# EAGLE design kiibohd_at90usb_ext_i2c_l (EAGLE 7.4.0)
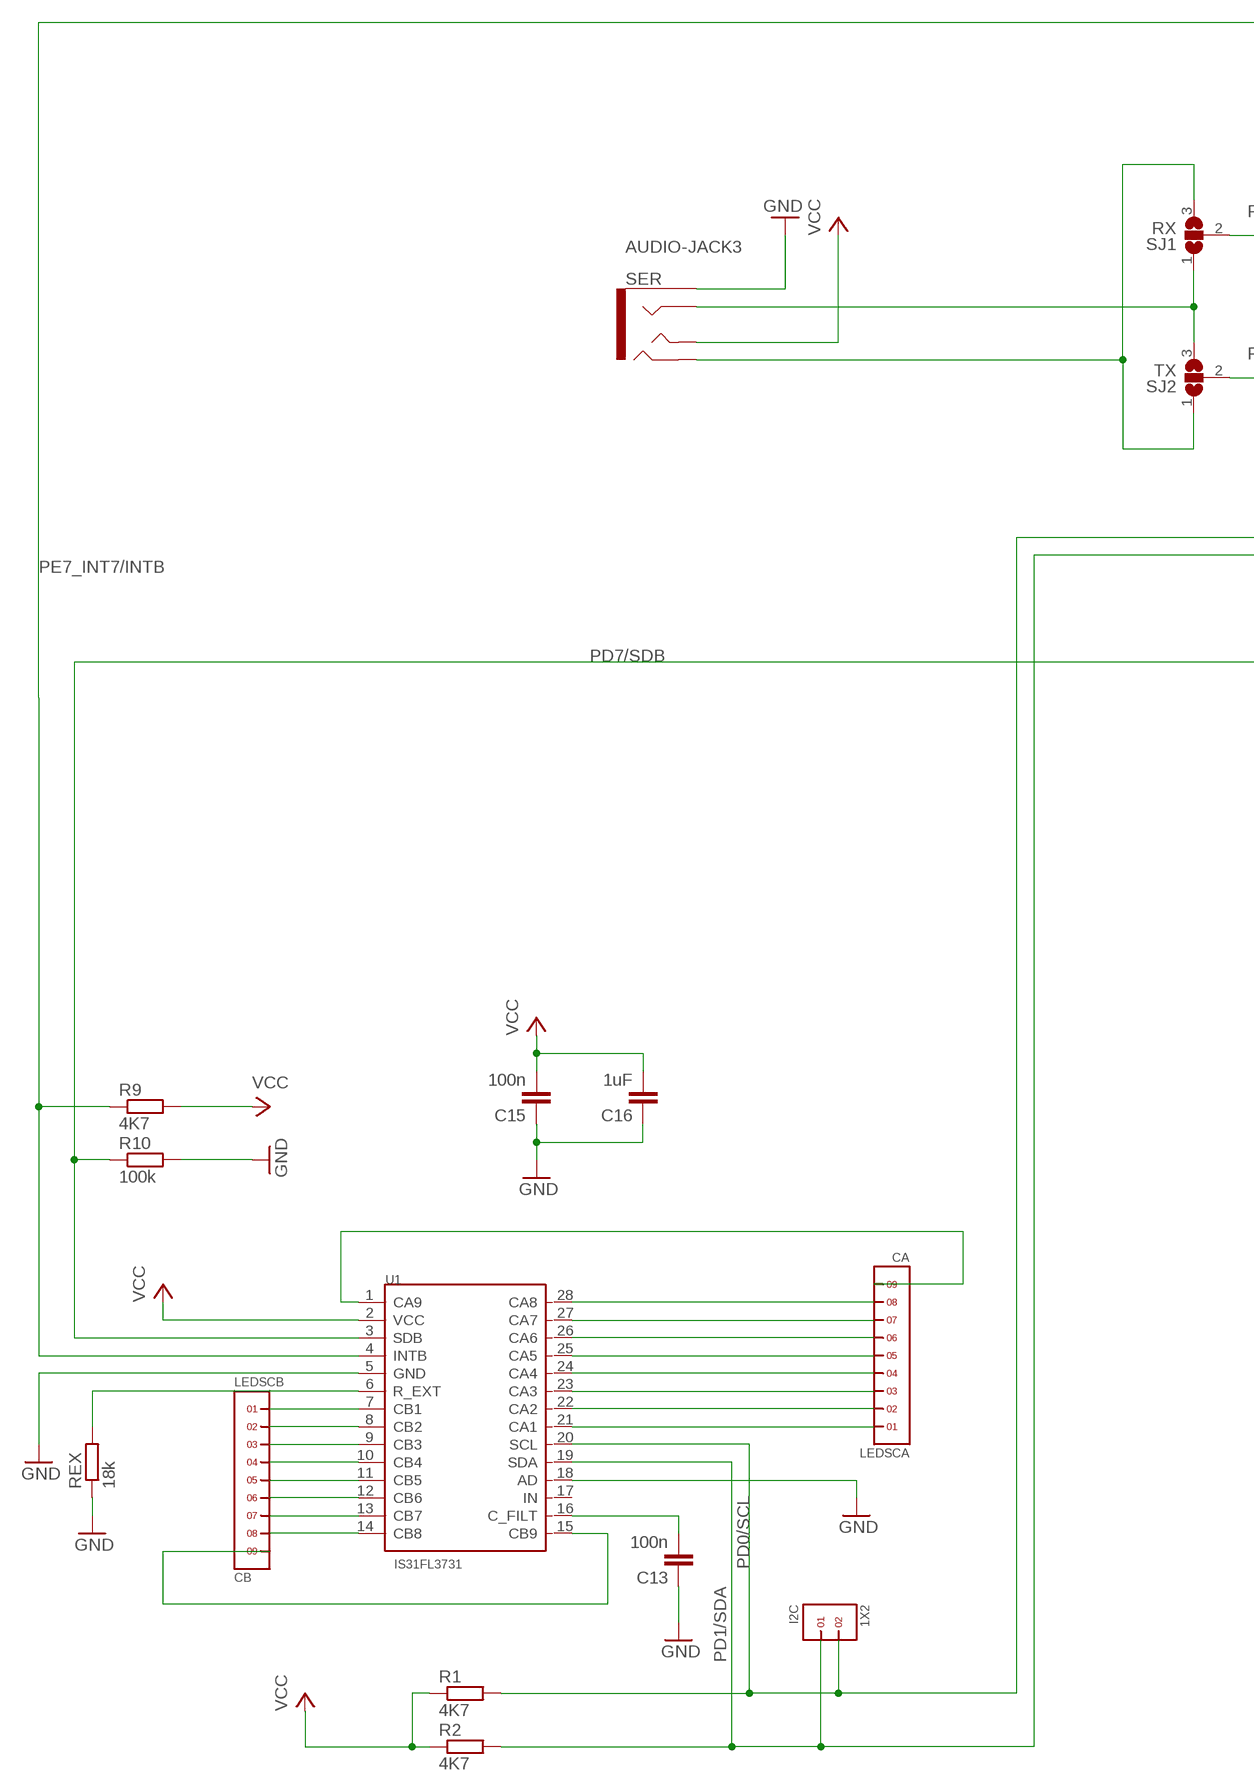
[diagram p0: schematic, sheet 1, part 1 of 2]
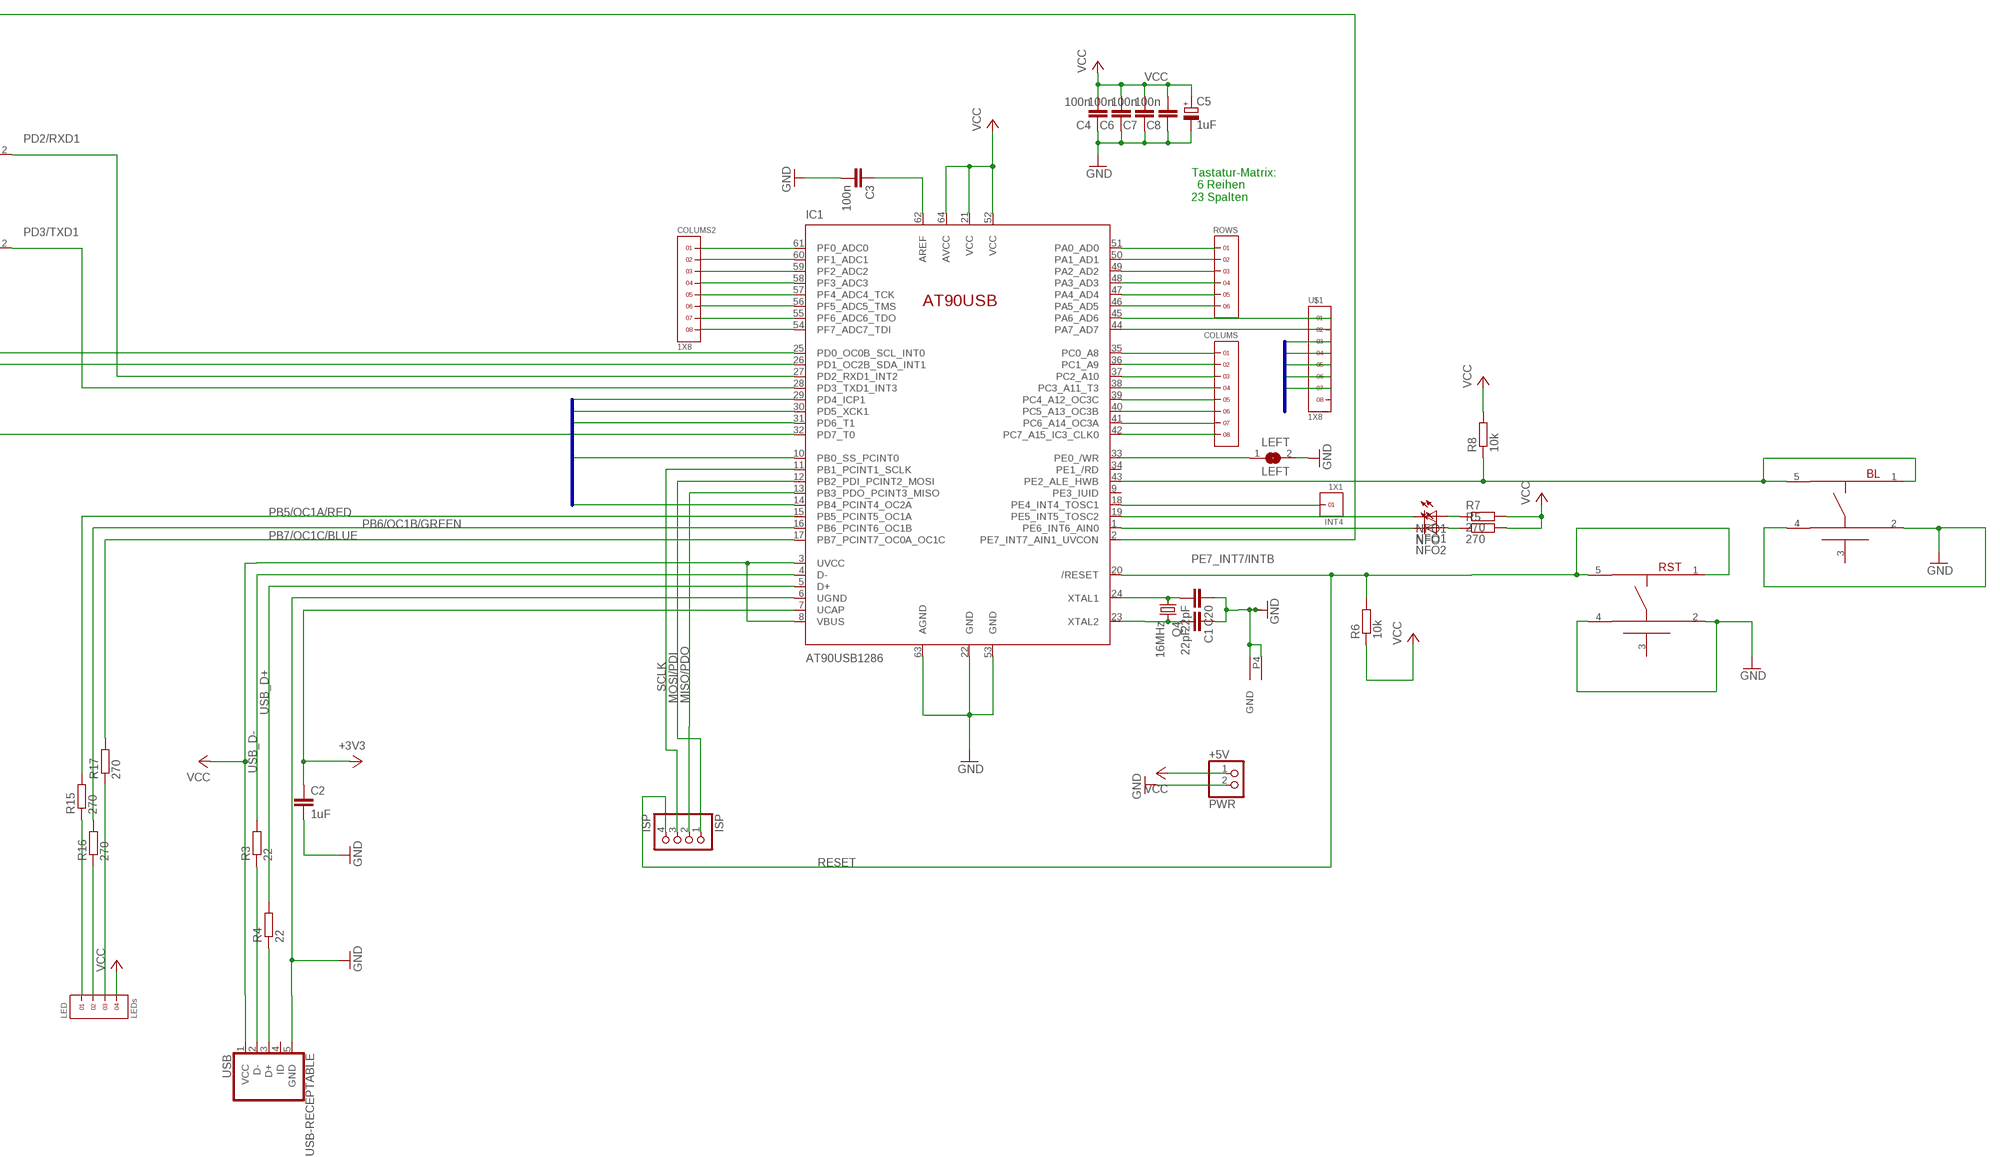
[diagram p1: schematic, sheet 1, part 2 of 2]

## Parts
+5V  PWR  PINHD-1X2  [1X02]
BL  KMSXXXG  [C&K-KMS-SWITCH]
C1  22pF  C-EUC1206  [C1206]
C2  1uF  C-EUC1206  [C1206]
C3  100n  C-EUC1206  [C1206]
C4  100n  C-EUC1206  [C1206]
C5  1uF  CPOL-EUE2-4  [E2-4]
C6  100n  C-EUC1206  [C1206]
C7  100n  C-EUC1206  [C1206]
C8  100n  C-EUC1206  [C1206]
C13  100n  C-EUC1206  [C1206]
C15  100n  C-EUC1206  [C1206]
C16  1uF  C-EUC1206  [C1206]
C20  22pF  C-EUC1206  [C1206]
COLUMS  1X8  [1X8]
COLUMS2  1X8  [1X8]
I2C  1X2  [1X2]
IC1  AT90USB1286  AT90USB-TQFP  [TQFP64]
INT4  1X1  [1X1]
ISP  ISP  PINHD-1X4  [1X04]
LED  LEDs  1X4  [1X4]
LEDSCA  CA  1X9  [1X9]
LEDSCB  CB  1X9  [1X9]
LEFT  LEFT  SJ  [SJ]
NFO  NFO2  LEDCHIP-LED0805  [CHIP-LED0805]
NFO1  NFO1  LEDCHIP-LED0805  [CHIP-LED0805]
Q4  16MHz  CRYSTALMJ  [MJ]
R1  4K7  R-EU_R1206  [R1206]
R2  4K7  R-EU_R1206  [R1206]
R3  22  R-EU_R1206  [R1206]
R4  22  R-EU_R1206  [R1206]
R5  270  R-EU_R1206  [R1206]
R6  10k  R-EU_R1206  [R1206]
R7  270  R-EU_R1206  [R1206]
R8  10k  R-EU_R1206  [R1206]
R9  4K7  R-EU_R1206  [R1206]
R10  100k  R-EU_R1206  [R1206]
R15  270  R-EU_R1206  [R1206]
R16  270  R-EU_R1206  [R1206]
R17  270  R-EU_R1206  [R1206]
REX  18k  R-EU_R1206  [R1206]
ROWS  1X6  [1X6]
RST  KMSXXXG  [C&K-KMS-SWITCH]
SER  AUDIO-JACK3  [AUDIO-JACK-TRRS-SMD]
SJ1  RX  SJ2W  [SJ_2]
SJ2  TX  SJ2W  [SJ_2]
U1  IS31FL3731  IS31FL3731(SSOP28)  [SSOP28-0.65-10.2X5.2MM]
U$1  1X8  [1X8]
USB  USB-RECEPTABLE  [FCI-10103594-0001LF]

## Nets
+3V3: C2.1 IC1.7(UCAP)
COL1/PC0: COLUMS.1 IC1.35(PC0_A8)
COL2/PC1: COLUMS.2 IC1.36(PC1_A9)
COL3: COLUMS.3 IC1.37(PC2_A10)
COL4: COLUMS.4 IC1.38(PC3_A11_T3)
COL5: COLUMS.5 IC1.39(PC4_A12_OC3C)
COL6: COLUMS.6 IC1.40(PC5_A13_OC3B)
COL8/PF0: COLUMS2.1 IC1.61(PF0_ADC0)
COL17/PA6: IC1.45(PA6_AD6) U$1.1
GND [gnd]: +5V.2 BL.2 BL.4 C1.1 C2.2 C3.2 C4.1 C5.- C6.1 C7.1 C8.1 C13.1 C15.1 C16.1 C20.1 IC1.6(UGND) IC1.22(GND) IC1.53(GND) IC1.63(AGND) LEFT.2 Q4.P2(GND) Q4.P4(GND1) R10.2 REX.1 RST.2 RST.4 SER.EARTH U1.5(GND) U1.18(AD) USB.5(GND)
MISO/PDO: IC1.13(PB3_PDO_PCINT3_MISO) ISP.2
MOSI/PDI: IC1.12(PB2_PDI_PCINT2_MOSI) ISP.1
N$1 [leddriver]: LEDSCA.1 U1.21(CA1)
N$2 [leddriver]: LEDSCA.2 U1.22(CA2)
N$3: SER.RING1 SJ1.1 SJ2.3
N$4 [leddriver]: LEDSCA.3 U1.23(CA3)
N$5 [leddriver]: LEDSCA.4 U1.24(CA4)
N$6 [leddriver]: LEDSCA.5 U1.25(CA5)
N$7 [leddriver]: LEDSCA.6 U1.26(CA6)
N$8 [leddriver]: LEDSCA.7 U1.27(CA7)
N$9 [leddriver]: LEDSCA.8 U1.28(CA8)
N$10 [leddriver]: LEDSCA.9 U1.1(CA9)
N$11 [leddriver]: LEDSCB.1 U1.7(CB1)
N$12 [leddriver]: LEDSCB.2 U1.8(CB2)
N$13 [leddriver]: LEDSCB.3 U1.9(CB3)
N$14 [leddriver]: LEDSCB.4 U1.10(CB4)
N$15 [leddriver]: LEDSCB.5 U1.11(CB5)
N$16 [leddriver]: LEDSCB.6 U1.12(CB6)
N$17 [leddriver]: LEDSCB.7 U1.13(CB7)
N$18 [leddriver]: LEDSCB.8 U1.14(CB8)
N$19 [leddriver]: LEDSCB.9 U1.15(CB9)
N$20: COLUMS2.2 IC1.60(PF1_ADC1)
N$21: COLUMS2.3 IC1.59(PF2_ADC2)
N$22: COLUMS2.4 IC1.58(PF3_ADC3)
N$23: R3.1 USB.2(D-)
N$24: C3.1 IC1.62(AREF)
N$25: SER.RING2 SJ1.3 SJ2.1
N$26: COLUMS2.5 IC1.57(PF4_ADC4_TCK)
N$27: COLUMS2.6 IC1.56(PF5_ADC5_TMS)
N$28: COLUMS2.7 IC1.55(PF6_ADC6_TDO)
N$29: IC1.50(PA1_AD1) ROWS.2
N$30: IC1.49(PA2_AD2) ROWS.3
N$31: IC1.48(PA3_AD3) ROWS.4
N$32: IC1.47(PA4_AD4) ROWS.5
N$33: IC1.46(PA5_AD5) ROWS.6
N$34: COLUMS2.8 IC1.54(PF7_ADC7_TDI)
N$35: IC1.18(PE4_INT4_TOSC1) INT4.1
N$36: IC1.44(PA7_AD7) U$1.2
N$37: IC1.33(PE0_/WR) LEFT.1
N$38: IC1.19(PE5_INT5_TOSC2) NFO1.C
N$39: NFO1.A R7.1
N$44: NFO.A R5.1
N$45: R4.1 USB.3(D+)
N$47: IC1.1(PE6_INT6_AIN0) NFO.C
N$53: COLUMS.7 IC1.41(PC6_A14_OC3A)
N$54: COLUMS.8 IC1.42(PC7_A15_IC3_CLK0)
N$57: REX.2 U1.6(R_EXT)
N$58: C13.2 U1.16(C_FILT)
N$64: C1.2 IC1.23(XTAL2) Q4.P3
N$65: C20.2 IC1.24(XTAL1) Q4.P1
N$67: LED.1 R15.1
N$68: LED.2 R16.1
N$69: LED.3 R17.1
N$74: BL.1 BL.5 IC1.43(PE2_ALE_HWB) R8.1
PB0: IC1.10(PB0_SS_PCINT0) U$1.6
PB4: IC1.14(PB4_PCINT4_OC2A) U$1.7
PB5/OC1A/RED: IC1.15(PB5_PCINT5_OC1A) R15.2
PB6/OC1B/GREEN: IC1.16(PB6_PCINT6_OC1B) R16.2
PB7/OC1C/BLUE: IC1.17(PB7_PCINT7_OC0A_OC1C) R17.2
PD0/SCL: I2C.2 IC1.25(PD0_OC0B_SCL_INT0) R1.2 U1.20(SCL)
PD1/SDA: I2C.1 IC1.26(PD1_OC2B_SDA_INT1) R2.2 U1.19(SDA)
PD2/RXD1: IC1.27(PD2_RXD1_INT2) SJ1.2
PD3/TXD1: IC1.28(PD3_TXD1_INT3) SJ2.2
PD4: IC1.29(PD4_ICP1) U$1.3
PD5: IC1.30(PD5_XCK1) U$1.4
PD6: IC1.31(PD6_T1) U$1.5
PD7/SDB: IC1.32(PD7_T0) R10.1 U1.3(SDB)
PE7_INT7/INTB: IC1.2(PE7_INT7_AIN1_UVCON) R9.1 U1.4(INTB)
RESET: IC1.20(/RESET) ISP.4 R6.2 RST.1 RST.5
ROW1: IC1.51(PA0_AD0) ROWS.1
SCLK: IC1.11(PB1_PCINT1_SCLK) ISP.3
USB_D+: IC1.5(D+) R4.2
USB_D-: IC1.4(D-) R3.2
VCC [power]: +5V.1 C4.2 C5.+ C6.2 C7.2 C8.2 C15.2 C16.2 IC1.3(UVCC) IC1.8(VBUS) IC1.21(VCC) IC1.52(VCC) IC1.64(AVCC) LED.4 R1.1 R2.1 R5.2 R6.1 R7.2 R8.2 R9.2 SER.TIP U1.2(VCC) USB.1(VCC)
Unconnected: BL.3 IC1.9(PE3_IUID) IC1.34(PE1_/RD) RST.3 U1.17(IN) U$1.8 USB.4(ID)

## Buses
PD4,PD5,PD6,PB0,PB4

## Notes on the sheet
- Tastatur-Matrix:
    6 Reihen
  23 Spalten

## Library data of the parts
+5V = pinhead:PINHD-1X2: PIN HEADER
BL RST = domestichacks:KMSXXXG: C&K KMS Series Microminiature SMT Side Actuated KMS221G KMS223G KMS231G KMS233G
C1-C4 C6-C8 C13 C15 C16 C20 = rcl:C-EU: CAPACITOR, European symbol
C5 = rcl:CPOL-EU: POLARIZED CAPACITOR, European symbol
COLUMS COLUMS2 U$1 = pinheaders_2mm:1X8
I2C = pinheaders_2mm:1X2
IC1 = controller-micro_atmel_jd:AT90USB
INT4 = pinheaders_2mm:1X1
ISP = pinhead:PINHD-1X4: PIN HEADER
LED = pinheaders_2mm:1X4
LEDSCA LEDSCB = pinheaders_2mm:1X9
LEFT = jumper:SJ: SMD solder JUMPER
NFO NFO1 = led:LED: LED OSRAM: - CHIPLED LG R971, LG N971, LY N971, LG Q971, LY Q971, LO R971, LY R971 LH N974, LH R974 LS Q976, LO Q976, LY Q976 LO Q996 - Hyper CHIPLED LW Q18S LB Q993, LB Q99A, LB R99A - SideLED LS A670, LO A670, LY A670, LG A670, LP A670 LB A673, LV A673, LT A673, LW A673 LH A674 LY A675 LS A676, LA A676, LO A676, LY A676, LW A676 LS A679, LY A679, LG A679 - Hyper Micro SIDELED® LS Y876, LA Y876, LO Y876, LY Y876 LT Y87S - SmartLED LW L88C, LW L88S LB L89C, LB L89S, LG L890 LS L89K, LO L89K, LY L89K LS L896, LA L896, LO L896, LY L896 - TOPLED LS T670, LO T670, LY T670, LG T670, LP T670 LSG T670, LSP T670, LSY T670, LOP T670, LYG T670 LG T671, LOG T671, LSG T671 LB T673, LV T673, LT T673, LW T673 LH T674 LS T676, LA T676, LO T676, LY T676, LB T676, LH T676, LSB T676, LW T676 LB T67C, LV T67C, LT T67C, LS T67K, LO T67K, LY T67K, LW E67C LS E67B, LA E67B, LO E67B, LY E67B, LB E67C, LV E67C, LT E67C LW T67C LS T679, LY T679, LG T679 LS T770, LO T770, LY T770, LG T770, LP T770 LB T773, LV T773, LT T773, LW T773 LH T774 LS E675, LA E675, LY E675, LS T675 LS T776, LA T776, LO T776, LY T776, LB T776 LHGB T686 LT T68C, LB T68C - Hyper Mini TOPLED® LB M676 - Mini TOPLED Santana® LG M470 LS M47K, LO M47K, LY M47K Source: http://www.osram.convergy.de LUXEON: - LUMILED® LXK2-PW12-R00, LXK2-PW12-S00, LXK2-PW14-U00, LXK2-PW14-V00 LXK2-PM12-R00, LXK2-PM12-S00, LXK2-PM14-U00 LXK2-PE12-Q00, LXK2-PE12-R00, LXK2-PE12-S00, LXK2-PE14-T00, LXK2-PE14-U00 LXK2-PB12-K00, LXK2-PB12-L00, LXK2-PB12-M00, LXK2-PB14-N00, LXK2-PB14-P00, LXK2-PB14-Q00 LXK2-PR12-L00, LXK2-PR12-M00, LXK2-PR14-Q00, LXK2-PR14-R00 LXK2-PD12-Q00, LXK2-PD12-R00, LXK2-PD12-S00 LXK2-PH12-R00, LXK2-PH12-S00 LXK2-PL12-P00, LXK2-PL12-Q00, LXK2-PL12-R00 Source: www.luxeon.com KINGBRIGHT: KA-3528ASYC Source: www.kingbright.com
Q4 = Crystals-new:CRYSTAL
R1-R10 R15-R17 REX = rcl:R-EU_: RESISTOR, European symbol
ROWS = pinheaders_2mm:1X6
SER = SparkFun-Connectors:AUDIO-JACK3: Audio jack - 3.5mm TRRS variety - two rings.
SJ1 SJ2 = jumper:SJ2W: SMD solder JUMPER
U1 = kiibohd:IS31FL3731(SSOP28): 310080003; MPN: WM8731SEDS/V
USB = daspilker:USB-RECEPTABLE: USB Receptable

## Net classes
0 default: width 0.203 mm, clearance 0.203 mm
1 power: width 0.457 mm, drill 0.406 mm, clearance 0.203 mm
2 gnd: width 0.457 mm, drill 0.406 mm, clearance 0.203 mm
3 leddriver: width 0.305 mm, drill 0.305 mm, clearance 0.203 mm

## Board
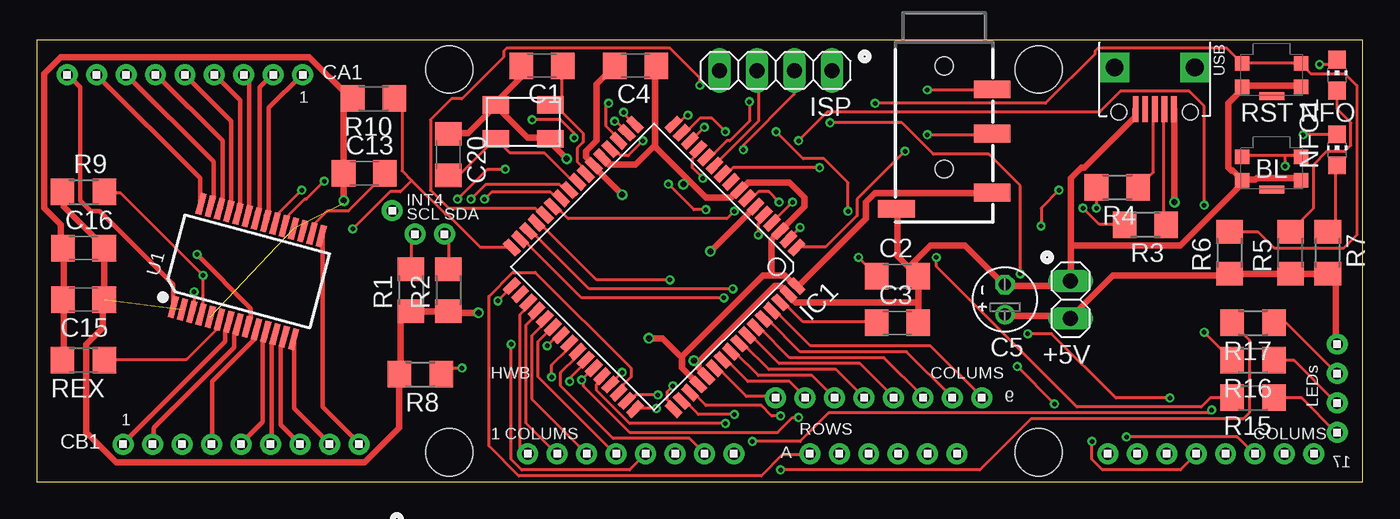
[diagram p2: board, top side]
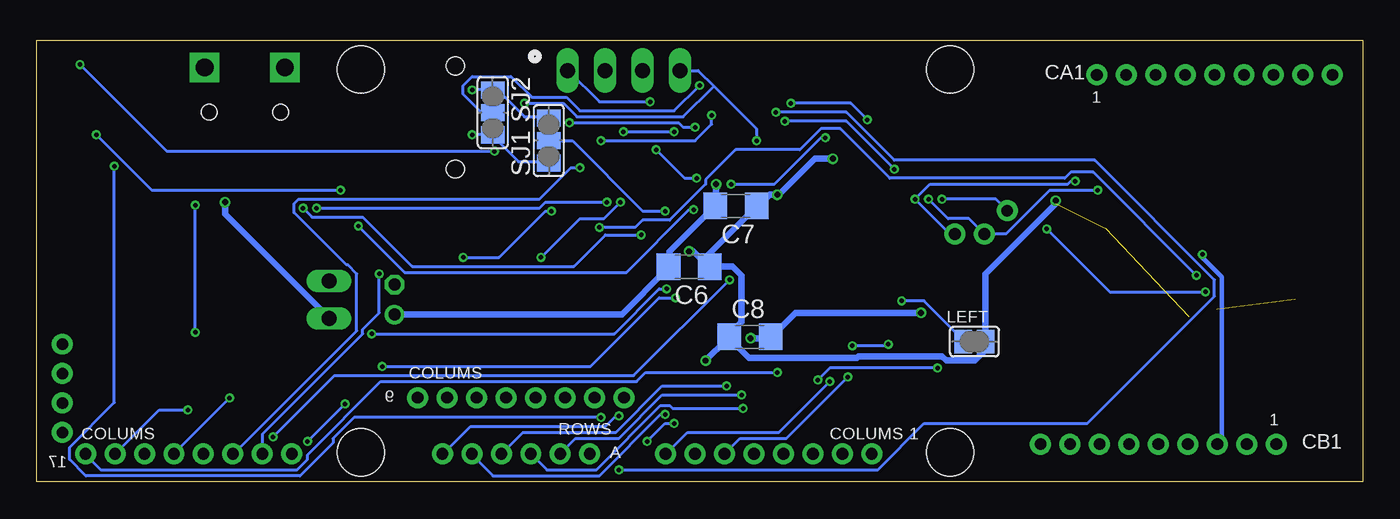
[diagram p3: board, bottom side, seen from below]

Size 90 x 30 mm. Coordinates in mm from the lower left corner, seen from the top.
Outline: 0,0 90,0 90,30 0,30 0,0
Copper layers (1*16): Top 0.035mm / dielectric 1.5mm / Bottom 0.035mm
Design rules "Elecrow_2-layer_eagle_rule *": minimum track width 6mil, minimum drill 12mil, track to track 8mil, track to pad 8mil, pad to pad 8mil, via to via 8mil, smd to smd 0mil, copper to edge 10mil, drill to drill 10mil, minimum pad ring 10mil, minimum via ring 6mil, stop-mask expansion 2mil, vias tented up to drill 100mil, thermal gap 10mil
Holes 3.2 mm at 68,28 28,2 68,2 28,28

### Footprints (pad centres in the part's own frame; a part is rotated, then mirrored left to right if it is on the bottom)
1X02 = drill 1.016 long: 1 -1.27,0; 2 1.27,0
C&K-KMS-SWITCH = smd 1 x 1: 1 -2,-0.8; 2 -2,0.8; 4 2,0.8; 5 2,-0.8 | smd 1.7 x 0.55: 3 0,1.425
C1206 = smd 1.6 x 1.8: 1 -1.4,0; 2 1.4,0
E2-4 = drill 0.813 pad 1.27: + -1.016,0 | drill 0.813 pad 1.27 octagon: - 1.016,0
1X8 = drill 0.8 pad 1.422: 1 -7,0; 2 -5,0; 3 -3,0; 4 -1,0; 5 1,0; 6 3,0; 7 5,0; 8 7,0
1X2 = drill 0.8 pad 1.422: 1 -1,0; 2 1,0
TQFP64 = smd 1.194 x 0.559: 1 -7.76,5.905; 2 -7.76,5.118; 3 -7.76,4.331; 4 -7.76,3.543; 5 -7.76,2.756; 6 -7.76,1.968; 7 -7.76,1.181; 8 -7.76,0.394; 9 -7.76,-0.394; 10 -7.76,-1.181; 11 -7.76,-1.968; 12 -7.76,-2.756; 13 -7.76,-3.543; 14 -7.76,-4.331; 15 -7.76,-5.118; 16 -7.76,-5.905; 33 7.76,-5.905; 34 7.76,-5.118; 35 7.76,-4.331; 36 7.76,-3.543; 37 7.76,-2.756; 38 7.76,-1.968; 39 7.76,-1.181; 40 7.76,-0.394; 41 7.76,0.394; 42 7.76,1.181; 43 7.76,1.968; 44 7.76,2.756; 45 7.76,3.543; 46 7.76,4.331; 47 7.76,5.118; 48 7.76,5.905 | smd 0.559 x 1.194: 17 -5.905,-7.76; 18 -5.118,-7.76; 19 -4.331,-7.76; 20 -3.543,-7.76; 21 -2.756,-7.76; 22 -1.968,-7.76; 23 -1.181,-7.76; 24 -0.394,-7.76; 25 0.394,-7.76; 26 1.181,-7.76; 27 1.968,-7.76; 28 2.756,-7.76; 29 3.543,-7.76; 30 4.331,-7.76; 31 5.118,-7.76; 32 5.905,-7.76; 49 5.905,7.76; 50 5.118,7.76; 51 4.331,7.76; 52 3.543,7.76; 53 2.756,7.76; 54 1.968,7.76; 55 1.181,7.76; 56 0.394,7.76; 57 -0.394,7.76; 58 -1.181,7.76; 59 -1.968,7.76; 60 -2.756,7.76; 61 -3.543,7.76; 62 -4.331,7.76; 63 -5.118,7.76; 64 -5.905,7.76
1X1 = drill 0.8 pad 1.422: 1 0,0
1X04 = drill 1.016 long: 1 -3.81,0; 2 -1.27,0; 3 1.27,0; 4 3.81,0
1X4 = drill 0.8 pad 1.422: 1 -3,0; 2 -1,0; 3 1,0; 4 3,0
1X9 = drill 0.8 pad 1.422: 1 -8,0; 2 -6,0; 3 -4,0; 4 -2,0; 5 0,0; 6 2,0; 7 4,0; 8 6,0; 9 8,0
SJ = smd 1.168 x 1.6: 1 -0.762,0; 2 0.762,0
CHIP-LED0805 = smd 1.2 x 1.2: A 0,-1.05; C 0,1.05
MJ = smd 1.8 x 1.2: P1 -1.85,-1.15; P2 1.85,-1.15; P3 1.85,1.15; P4 -1.85,1.15
R1206 = smd 1.6 x 1.803: 1 -1.422,0; 2 1.422,0
1X6 = drill 0.8 pad 1.422: 1 -5,0; 2 -3,0; 3 -1,0; 4 1,0; 5 3,0; 6 5,0
AUDIO-JACK-TRRS-SMD = smd 1.2 x 2.5: EARTH 11.3,-3.25; RING1 6.2,3.25; RING2 3.2,3.25; TIP 10.2,3.25 | hole 1.2: 1.6,0; 8.6,0
SJ_2 = smd 1.168 x 1.6: 1 -1.524,0; 2 0,0; 3 1.524,0
SSOP28-0.65-10.2X5.2MM = smd 0.4 x 1.5: 1 -4.225,-3.625; 2 -3.575,-3.625; 3 -2.925,-3.625; 4 -2.275,-3.625; 5 -1.625,-3.625; 6 -0.975,-3.625; 7 -0.325,-3.625; 8 0.325,-3.625; 9 0.975,-3.625; 10 1.625,-3.625; 11 2.275,-3.625; 12 2.925,-3.625; 13 3.575,-3.625; 14 4.225,-3.625; 15 4.225,3.625; 16 3.575,3.625; 17 2.925,3.625; 18 2.275,3.625; 19 1.625,3.625; 20 0.975,3.625; 21 0.325,3.625; 22 -0.325,3.625; 23 -0.975,3.625; 24 -1.625,3.625; 25 -2.275,3.625; 26 -2.925,3.625; 27 -3.575,3.625; 28 -4.225,3.625
FCI-10103594-0001LF = smd 0.4 x 1.75: 1 -1.3,4.525; 2 -0.65,4.525; 3 0,4.525; 4 0.65,4.525; 5 1.3,4.525 | drill 1.2 pad 2 square: P$3 -2.725,1.7; P$4 2.725,1.7 | hole 1.05: -2.425,4.73; 2.425,4.73

### Placement (x,y rotation side)
+5V  70.17,12.38 90 top
BL  83.82,21.27 180 top
C1  34.29,28.26 0 top
C2  58.42,13.97 0 top
C3  58.42,10.79 0 top
C4  40.64,28.26 0 top
C5  65.72,12.38 90 top
C6  45.72,14.61 180 bottom
C7  42.55,18.73 180 bottom
C8  41.59,9.84 0 bottom
C13  22.23,20.95 0 top
C15  3.17,12.38 0 top
C16  3.17,15.88 0 top
C20  27.94,22.23 270 top
COLUMS  40.32,1.91 0 top
COLUMS2  57.15,5.71 180 top
I2C  26.67,16.83 180 top
IC1  41.91,14.61 225 top
INT4  24.13,18.41 0 top
ISP  50.16,27.94 180 top
LED  88.27,6.35 90 top
LEDSCA  10.05,27.64 180 top
LEDSCB  13.86,2.56 0 top
LEFT  26.35,9.53 0 bottom
NFO  88.27,27.62 0 top
NFO1  88.27,22.54 0 top
Q4  33.02,24.45 0 top
R1  25.4,13.02 90 top
R2  27.94,13.02 90 top
R3  75.25,17.46 180 top
R4  73.34,20 180 top
R5  85.09,15.56 270 top
R6  80.96,15.56 90 top
R7  87.63,15.56 270 top
R8  26.04,7.3 180 top
R9  3.17,19.68 180 top
R10  22.86,26.04 180 top
R15  82.55,5.71 180 top
R16  82.55,8.26 180 top
R17  82.55,10.79 180 top
REX  3.17,8.26 0 top
ROWS  57.47,1.91 180 top
RST  83.82,27.62 180 top
SER  61.59,29.84 270 top
SJ1  55.24,23.18 90 bottom
SJ2  59.05,25.08 270 bottom
U1  14.29,14.29 345 top
U$1  79.69,1.91 180 top
USB  75.88,29.84 180 top

### Tracks (layer width: path | path; a pad name or v marks a point on that pad's centre or on a via)
+3V3  (via drill 0.3)
  Top 0.203: v50.39,19 49.68,19.71 48.97,19.71 48.56,19.3 48.26,19.3 IC1.7 | v55.78,15.24 57,14.02 C2.1
  Bottom 0.203: v50.39,19 51.51,17.88 53.14,17.88 v55.78,15.24
COL1/PC0
  Top 0.203: IC1.35 33.33,12.09 33.33,11.89 32.82,11.38 32.82,2.34 33.22,1.93 COLUMS.1
COL2/PC1
  Top 0.203: IC1.36 33.83,11.58 33.83,11.28 33.22,10.67 33.22,3.96 35.26,1.93 COLUMS.2
COL3
  Top 0.203: IC1.37 34.44,10.97 34.44,10.77 33.63,9.96 33.63,5.59 37.29,1.93 COLUMS.3
COL4
  Top 0.203: IC1.38 34.95,10.46 34.04,9.55 34.04,7.11 39.32,1.83 COLUMS.4
COL5  (via drill 0.3)
  Top 0.203: v34.65,9.25 35.26,9.86 35.56,9.86 IC1.39 | v32.21,9.35 32.21,1.52 32.92,0.81 40.23,0.81 41.25,1.83 COLUMS.5
  Bottom 0.203: v34.65,9.25 32.31,9.25 v32.21,9.35
COL6  (via drill 0.3)
  Top 0.203: v34.95,7.11 34.95,7.92 36.07,9.04 36.07,9.35 IC1.40
  Bottom 0.203: v34.95,7.11 39.12,2.95 42.27,2.95 43.28,1.93 COLUMS.6
COL8/PF0
  Top 0.203: IC1.61 49.99,11.58 50.19,11.58 52.53,9.25 60.66,9.25 64.11,5.79 COLUMS2.1
COL17/PA6  (via drill 0.3)
  Top 0.203: v39.73,7.42 39.01,6.71 IC1.45
  Bottom 0.203: v39.73,7.42 48.67,7.42 49.28,6.81 66.65,6.81 71.63,1.83 71.63,1.52 72.34,0.81 85.65,0.81 86.67,1.83 U$1.1
GND  (via drill 0.41)  (2 unrouted)
  Top 0.457: 44.91,8.13 44.91,7.72 45.41,7.21 IC1.53 | 44.91,8.13 50.09,13.31 50.49,13.31 51,12.8 IC1.63 51.1,12.6 51.51,12.19 59.64,12.19 59.84,12.19 | 59.84,12.19 59.84,13.92 C2.2 | 59.84,12.19 59.84,10.87 C3.2 | SER.EARTH 58.42,18.49 58.42,15.34 59.64,14.12 C2.2 | BL.4 81.89,20.52 82.7,20.52 82.8,20.62 85.65,20.62 85.75,20.52 BL.2 | RST.2 85.75,26.92 81.89,26.92 RST.4 81.79,26.62 80.87,25.7 80.87,21.34 81.08,21.13 81.18,21.13 81.69,20.62 BL.4 | 70.21,16.05 70.21,13.72 +5V.2 70,13.51 69.8,13.31 65.73,13.31 C5.- 65.53,13.51 62.99,16.05 60.66,16.05 59.33,14.73 C2.2 | 70.21,16.05 70.21,20.62 70.92,21.34 71.12,21.34 74.57,24.79 74.57,25.3 USB.5 | BL.4 81.69,20.32 81.69,20.12 77.62,16.05 70.41,16.05 70.21,16.05 | C20.1 27.94,23.67 29.26,23.67 31.09,25.5 Q4.P4 | Q4.P4 31.29,25.4 33.33,23.37 34.85,23.37 Q4.P2 34.85,23.06 v35.97,21.95 | C1.1 32.82,28.25 32.82,27.43 31.19,25.81 Q4.P4 | C4.1 39.22,28.25 38,27.03 38,23.16 37.29,22.45 37.29,22.05 37.8,21.54 IC1.22 37.9,21.34 v39.73,19.51 | v45.72,15.65 48.77,18.69 IC1.6 | REX.1 1.83,8.33 1.83,12.19 C15.1 1.83,12.39 1.83,15.85 C16.1 1.63,16.05 1.63,17.48 0.51,18.59 0.51,27.74 1.63,28.85 18.49,28.85 21.23,26.11 R10.2 21.44,26.01 20.83,25.4 20.83,21.03 C13.1 20.83,20.73 v20.83,19.1 | v44.6,8.23 44.7,8.23 44.91,8.13
  Bottom 0.457: v45.72,15.65 45.41,15.65 44.4,14.63 C6.1 | C6.1 44.7,15.14 41.15,18.69 C7.1 40.95,18.8 40.23,19.51 v39.73,19.51 39.52,19.61 37.19,21.95 v35.97,21.95 | C8.1 42.98,9.75 41.66,8.43 34.34,8.43 34.24,8.53 28.55,8.53 28.25,8.23 26.31,8.23 25.6,8.94 25.6,9.45 LEFT.2 25.6,9.75 25.6,14.12 20.83,18.9 v20.83,19.1 | C6.1 44.09,14.63 42.77,14.63 42.16,14.02 42.16,10.87 42.98,10.06 C8.1 | v44.6,8.23 43.18,9.65 C8.1
MISO/PDO  (via drill 0.3)
  Top 0.203: v45.21,20.62 44.5,21.34 44.5,21.95 44.81,22.25 44.81,22.55 IC1.13 | v47.95,22.55 47.95,22.86 51.41,26.31 51.41,27.94 ISP.2
  Bottom 0.203: v45.21,20.62 46.02,20.62 v47.95,22.55
MOSI/PDI  (via drill 0.3)
  Top 0.203: v48.36,25.81 48.36,24.49 47.04,23.16 46.84,23.16 45.72,22.05 45.52,22.05 IC1.12
  Bottom 0.203: v48.36,25.81 51.82,25.81 53.95,27.94 ISP.1
N$1
  Top 0.305: U1.21 15.54,17.78 15.54,18.09 15.75,18.29 15.75,25.4 17.98,27.64 LEDSCA.1
N$2
  Top 0.305: U1.22 14.94,17.88 14.94,18.29 15.14,18.49 15.14,26.82 15.95,27.64 LEDSCA.2
N$3  (via drill 0.3)
  Top 0.203: v60.45,23.57 64.82,23.57 SER.RING1
  Bottom 0.203: SJ1.1 55.27,21.74 57.3,21.74 59.03,23.47 SJ2.3 59.13,23.57 v60.45,23.57
N$4
  Top 0.305: U1.23 14.33,18.09 14.33,18.49 14.43,18.59 14.43,27.33 14.12,27.64 LEDSCA.3
N$5
  Top 0.305: U1.24 13.72,18.29 13.72,18.8 13.82,18.9 13.82,25.91 12.09,27.64 LEDSCA.4
N$6
  Top 0.305: U1.25 13.11,18.39 13.11,19 13.21,19.1 13.21,24.49 LEDSCA.5
N$7
  Top 0.305: U1.26 12.5,18.59 12.5,19.2 12.6,19.3 12.6,23.16 8.13,27.64 LEDSCA.6
N$8
  Top 0.305: U1.27 11.79,18.8 11.79,19.1 11.99,19.3 11.99,21.74 6.1,27.64 LEDSCA.7
N$9
  Top 0.305: U1.28 11.07,18.9 11.07,20.62 4.06,27.64 LEDSCA.8
N$10
  Top 0.305: U1.1 9.25,11.89 9.25,13.41 4.27,18.39 3.66,18.39 2.95,19.1 2.95,26.82 2.13,27.64 LEDSCA.9
N$11
  Top 0.305: U1.7 13.01,10.77 13.01,10.46 12.8,10.26 12.8,9.55 5.89,2.64 LEDSCB.1
N$12
  Top 0.305: U1.8 13.61,10.67 13.61,10.16 13.41,9.96 13.41,9.14 7.92,3.66 7.92,2.64 LEDSCB.2
N$13  (via drill 0.3)
  Top 0.305: v10.87,15.44 14.53,11.79 14.53,11.18 14.33,10.97 14.33,10.57 U1.9
  Bottom 0.305: v10.87,15.44 10.87,15.24 9.55,13.92 9.55,2.95 9.86,2.64 LEDSCB.3
N$14
  Top 0.305: U1.10 14.83,10.36 14.83,9.75 11.89,6.81 11.89,2.64 LEDSCB.4
N$15
  Top 0.305: U1.11 15.54,10.16 15.54,9.86 15.34,9.65 15.34,4.06 13.92,2.64 LEDSCB.5
N$16
  Top 0.305: U1.12 16.15,9.96 16.15,9.65 15.95,9.45 15.95,2.64 LEDSCB.6
N$17
  Top 0.305: U1.13 16.76,9.86 16.76,9.45 16.56,9.25 16.56,3.86 17.78,2.64 LEDSCB.7
N$18
  Top 0.305: U1.14 17.48,9.65 17.48,4.98 19.81,2.64 LEDSCB.8
N$19
  Top 0.305: U1.15 19.41,16.66 19.41,5.08 21.84,2.64 LEDSCB.9
N$20
  Top 0.203: IC1.60 49.38,10.97 49.68,10.97 51.82,8.84 59.03,8.84 62.08,5.79 COLUMS2.2
N$21
  Top 0.203: IC1.59 48.87,10.46 49.07,10.46 51.1,8.43 57.51,8.43 60.15,5.79 COLUMS2.3
N$22
  Top 0.203: IC1.58 48.26,9.86 48.56,9.86 50.39,8.03 55.88,8.03 58.12,5.79 COLUMS2.4
N$23
  Top 0.203: USB.2 76.5,25.3 76.5,17.58 76.61,17.48 R3.1
N$24
  Top 0.203: IC1.62 50.49,12.09 50.8,12.09 52.02,10.87 57,10.87 C3.1
N$25  (via drill 0.3)
  Top 0.203: v60.45,26.62 64.82,26.62 SER.RING2
  Bottom 0.203: SJ1.3 55.27,24.79 56.9,24.79 58.62,26.52 59.03,26.52 SJ2.1 59.13,26.62 v60.45,26.62
N$26
  Top 0.203: IC1.57 47.75,9.35 47.95,9.35 49.68,7.62 54.25,7.62 56.08,5.79 COLUMS2.5
N$27
  Top 0.203: IC1.56 47.14,8.84 47.35,8.84 48.97,7.21 52.63,7.21 54.05,5.79 COLUMS2.6
N$28
  Top 0.203: IC1.55 46.63,8.23 46.84,8.23 48.26,6.81 51.1,6.81 52.12,5.79 COLUMS2.7
N$29  (via drill 0.3)
  Top 0.203: v47.35,4.57 44.91,4.57 43.99,5.49 43.79,5.49 IC1.50
  Bottom 0.203: v47.35,4.57 47.65,4.57 51.82,0.41 59.03,0.41 60.45,1.83 ROWS.2
N$30  (via drill 0.3)
  Top 0.203: v43.18,6.5 42.77,6.1 42.77,5.59 43.18,5.18 43.18,4.98 IC1.49
  Bottom 0.203: v43.18,6.5 47.55,6.5 50.7,3.35 57,3.35 58.42,1.93 ROWS.3
N$31  (via drill 0.3)
  Top 0.203: v42.06,4.98 40.64,4.98 IC1.48
  Bottom 0.203: v42.06,4.98 46.84,4.98 47.04,5.18 47.65,5.18 52.02,0.81 55.37,0.81 56.39,1.83 ROWS.4
N$32  (via drill 0.3)
  Top 0.203: v42.16,5.89 40.64,5.89 40.34,5.59 40.13,5.59 IC1.47
  Bottom 0.203: v42.16,5.89 47.55,5.89 50.49,2.95 53.44,2.95 54.46,1.93 ROWS.5
N$33
  Top 0.203: IC1.46 39.52,6.1 39.52,6.3 40.34,7.11 40.34,7.72 33.83,14.22 32.31,14.22 30.68,12.6 30.68,2.44 32.72,0.41 49.17,0.41 50.6,1.83 52.43,1.83 ROWS.6
N$34
  Top 0.203: IC1.54 46.02,7.72 46.23,7.72 48.16,5.79 50.09,5.79 COLUMS2.8
N$35  (via drill 0.3)
  Top 0.203: v39.22,24.49 39.32,24.49 40.03,23.77 IC1.18 | v31.8,21.23 30.58,21.23 v28.55,19.2
  Bottom 0.203: v39.22,24.49 35.05,24.49 v31.8,21.23 | v28.55,19.2 24.89,19.2 24.18,18.49 INT4.1
N$36  (via drill 0.3)
  Top 0.203: v46.74,3.96 40.23,3.96 38,6.2 38,6.6 38.3,6.91 38.3,7.11 IC1.44 | v48.56,2.74 51.82,2.74 53.75,4.67 79.55,4.67 v79.76,4.88
  Bottom 0.203: v46.74,3.96 47.35,3.96 v48.56,2.74 | v79.76,4.88 81.69,4.88 84.63,1.93 U$1.2
N$37  (via drill 0.3)
  Top 0.203: v31.29,12.29 32.21,13.21 IC1.33
  Bottom 0.203: v31.29,12.29 29.77,12.29 27.03,9.55 LEFT.1
N$38  (via drill 0.3)
  Top 0.203: v38.81,25.7 38.61,25.5 38.61,24.18 39.42,23.37 39.42,23.16 IC1.19 | v33.63,24.59 35.56,24.59 36.47,23.67 v36.47,23.37 | v42.88,20.22 44.6,18.49 v45.41,18.49 | v68.17,17.37 68.17,18.59 v69.39,19.81 | v85.95,23.57 88.19,23.57 NFO1.C
  Bottom 0.203: v38.81,25.7 34.75,25.7 v33.63,24.59 | v36.47,23.37 36.78,23.37 39.93,20.22 v42.88,20.22 | v45.41,18.49 45.72,18.49 49.99,14.22 65.02,14.22 v68.17,17.37 | v69.39,19.81 82.19,19.81 v85.95,23.57
N$39
  Top 0.203: NFO1.A 88.19,21.44 88.19,17.58 87.68,17.07 R7.1
N$44
  Top 0.203: NFO.A 88.29,26.52 88.29,25.3 89.2,24.38 89.2,22.86 88.8,22.45 87.58,22.45 86.67,21.54 86.67,18.59 85.14,17.07 R5.1
N$45
  Top 0.203: USB.3 75.79,25.3 75.79,21.03 74.78,20.02 R4.1
N$47  (via drill 0.3)
  Top 0.203: v58.93,22.45 55.68,19.2 55.68,18.09 53.54,15.95 51.61,15.95 IC1.1 | v87.07,28.35 87.88,28.35 88.19,28.65 NFO.C
  Bottom 0.203: v58.93,22.45 81.18,22.45 v87.07,28.35
N$53
  Top 0.203: IC1.41 36.68,8.84 36.68,8.53 35.56,7.42 35.56,6.5 39.12,2.95 44.3,2.95 45.31,1.93 COLUMS.7
N$54  (via drill 0.3)
  Top 0.203: v36.17,6.81 36.17,7.01 37.19,8.03 37.19,8.23 IC1.42
  Bottom 0.203: v36.17,6.81 39.62,3.35 45.82,3.35 47.24,1.93 COLUMS.8
N$57
  Top 0.203: U1.6 12.39,10.97 12.39,10.57 10.16,8.33 4.67,8.33 REX.2
N$58
  Top 0.203: U1.16 18.69,16.87 18.69,17.37 19.71,18.39 21.13,18.39 23.67,20.93 C13.2
N$64
  Top 0.203: IC1.23 37.19,20.93 37.19,21.23 36.68,21.74 36.68,22.66 37.08,23.06 37.08,23.67 35.26,25.5 34.95,25.5 Q4.P3 35.36,25.5 35.66,25.81 35.66,28.25 C1.2
N$65
  Top 0.203: IC1.24 36.68,20.42 36.37,20.42 34.44,22.35 32.11,22.35 31.19,23.27 Q4.P1 31.09,23.27 28.65,20.83 C20.2
N$67
  Top 0.203: R15.1 84.02,5.69 85.85,5.69 88.19,3.35 LED.1
N$68
  Top 0.203: R16.1 84.02,8.23 85.34,8.23 88.19,5.38 LED.2
N$69
  Top 0.203: R17.1 84.02,10.77 84.84,10.77 88.19,7.42 LED.3
N$74  (via drill 0.3)
  Top 0.203: 84.73,22.15 85.75,22.15 BL.1 | 84.73,22.15 81.89,22.15 BL.5 | v28.85,7.72 27.94,7.72 27.53,7.32 R8.1 | IC1.43 37.8,7.72 v36.98,6.91 37.08,6.91 37.08,6.5 40.23,3.35 50.29,3.35 51.31,4.37 v51.71,4.37 | v84.73,21.44 84.73,22.15
  Bottom 0.203: v36.98,6.91 36.17,7.72 v28.85,7.72 | v84.73,21.44 84.73,5.38 87.78,2.34 87.78,1.52 86.67,0.41 72.14,0.41 69.9,2.64 69.9,2.95 68.48,4.37 v51.71,4.37
PB0  (via drill 0.3)
  Top 0.203: v53.14,21.34 47.24,21.34 46.84,20.93 46.63,20.93 IC1.10
  Bottom 0.203: v53.14,21.34 53.75,21.34 55.88,19.2 72.24,19.2 72.54,18.9 72.54,18.29 68.99,14.73 68.89,14.73 68.28,14.12 68.28,10.26 76.61,1.93 U$1.6
PB4  (via drill 0.3)
  Top 0.203: v45.31,24.08 44.4,23.16 IC1.14 | v53.85,24.38 58.73,24.38 60.86,22.25 64.62,22.25 66.75,20.12 v66.75,14.12
  Bottom 0.203: v45.31,24.08 46.13,24.08 46.43,24.38 v53.85,24.38 | v66.75,14.12 66.75,11.48 67.87,10.36 67.87,10.06 74.68,3.25 74.68,1.93 U$1.7
PB5/OC1A/RED  (via drill 0.3)
  Top 0.203: v46.74,23.77 45.82,24.69 45.01,24.69 44.09,23.77 43.79,23.77 IC1.15 | v50.19,23.77 52.02,21.95 53.44,21.95 55.07,20.32 v55.07,18.39 | v61.06,15.24 61.06,14.63 70.61,5.08 79.05,5.08 79.65,5.69 81.08,5.69 R15.2
  Bottom 0.203: v50.19,23.77 v46.74,23.77 | v55.07,18.39 55.47,18.39 58.62,15.24 v61.06,15.24
PB6/OC1B/GREEN  (via drill 0.3)
  Top 0.203: v44.2,24.89 44.09,24.89 43.48,24.28 43.28,24.28 IC1.16 | v51.71,23.16 53.65,25.09 72.14,25.09 73.56,26.52 78.23,26.52 79.25,25.5 v79.25,18.8 | v79.25,10.16 81.08,8.33 R16.2
  Bottom 0.203: v44.2,24.89 44.2,24.28 45.31,23.16 v51.71,23.16 | v79.25,10.16 v79.25,18.8
PB7/OC1C/BLUE  (via drill 0.3)
  Top 0.203: v39.83,25.09 39.83,24.99 40.54,24.28 IC1.17 | v50.49,0.81 64.01,0.81 67.46,4.27 81.89,4.27 82.3,4.67 82.3,9.65 81.18,10.77 R17.2
  Bottom 0.203: v39.83,25.09 35.05,25.09 31.8,21.84 18.19,21.84 10.06,13.72 10.06,12.6 18.69,3.96 29.77,3.96 32.92,0.81 v50.49,0.81
PD0/SCL  (via drill 0.3)
  Top 0.203: v29.46,19.2 30.48,20.22 35.46,20.22 35.76,19.91 36.07,19.91 IC1.25 | v17.98,19.81 16.26,18.09 16.26,17.58 U1.20 | R1.2 25.4,14.53 25.4,16.56 25.6,16.76 I2C.2
  Bottom 0.203: v29.46,19.2 28.14,17.88 26.72,17.88 25.7,16.87 I2C.2 25.6,16.87 24.18,16.87 21.23,19.81 v17.98,19.81
PD1/SDA  (via drill 0.3)
  Top 0.203: v30.38,19.2 30.89,19.71 34.85,19.71 35.26,19.3 35.56,19.3 IC1.26 | v19.51,20.42 18.29,19.2 18.19,19.2 16.87,17.88 16.87,17.37 U1.19 | R2.2 27.94,14.53 27.94,16.56 27.74,16.76 I2C.1
  Bottom 0.203: I2C.1 27.74,16.87 28.04,16.87 v30.38,19.2 29.36,20.22 20.02,20.22 19.81,20.42 v19.51,20.42
PD2/RXD1  (via drill 0.3)
  Top 0.203: v47.35,18.39 46.84,17.88 36.07,17.88 35.26,18.69 35.05,18.69 IC1.27
  Bottom 0.203: v47.35,18.39 48.87,18.39 53.65,23.16 55.17,23.16 SJ1.2
PD3/TXD1  (via drill 0.3)
  Top 0.203: v45.01,26.92 45.01,27.43 42.98,29.46 31.9,29.46 31.7,29.26 31.7,28.85 28.85,26.01 28.14,26.01 26.72,24.59 26.72,19.81 27.94,18.59 33.83,18.59 34.24,18.19 34.44,18.19 IC1.28
  Bottom 0.203: v45.01,26.92 46.74,25.2 53.14,25.2 54.05,26.11 56.39,26.11 57.81,27.53 60.45,27.53 61.06,26.92 61.06,26.31 59.84,25.09 59.13,25.09 SJ2.2
PD4  (via drill 0.3)
  Top 0.203: v42.98,13.72 38,13.72 34.14,17.58 33.93,17.58 IC1.29 | v73.97,3.05 81.48,3.05 82.6,1.93 U$1.3
  Bottom 0.203: v42.98,13.72 49.48,7.21 69.8,7.21 v73.97,3.05
PD5  (via drill 0.3)
  Top 0.203: v47.24,13.11 37.49,13.11 33.63,16.97 33.43,16.97 IC1.30 | v67.26,10.06 68.89,10.06 73.25,5.69 v76.91,5.69
  Bottom 0.203: v47.24,13.11 47.75,13.11 50.8,10.06 v67.26,10.06 | v76.91,5.69 80.67,1.93 U$1.4
PD6  (via drill 0.3)
  Top 0.203: v46.63,12.5 36.98,12.5 33.02,16.46 32.82,16.46 IC1.31 | v69.09,5.28 v66.55,7.82 | v71.63,2.74 71.63,1.52 72.34,0.81 77.62,0.81 78.64,1.83 U$1.5
  Bottom 0.203: v46.63,12.5 47.75,12.5 52.43,7.82 v66.55,7.82 | v71.63,2.74 v69.09,5.28
PD7/SDB  (via drill 0.3)
  Top 0.203: 25.45,20.47 24.79,21.13 24.79,25.5 24.28,26.01 R10.1 | 25.45,20.47 27.74,18.19 27.84,18.19 30.07,15.95 32.21,15.95 IC1.32 | v10.67,12.9 10.67,12.29 10.57,12.19 10.57,11.58 U1.3 | v21.44,17.17 23.98,19.71 24.69,19.71 25.4,20.42 25.45,20.47
  Bottom 0.203: v10.67,12.9 17.17,12.9 v21.44,17.17
PE7_INT7/INTB  (via drill 0.3)
  Top 0.203: v51.82,17.27 51.1,16.56 IC1.2 | U1.4 11.18,11.38 11.28,11.48 v11.28,14.02 5.69,19.61 4.67,19.61 R9.1
  Bottom 0.203: v51.82,17.27 49.38,17.27 48.87,17.78 47.04,17.78 44.6,20.22 44.6,20.52 42.57,22.55 38.2,22.55 36.78,23.98 35.46,23.98 32.11,20.62 20.22,20.62 19.81,21.03 18.29,21.03 v11.28,14.02
RESET  (via drill 0.3)
  Top 0.203: v41.15,23.16 40.13,22.15 39.62,22.15 39.22,22.55 39.01,22.55 IC1.20 | R6.2 80.97,16.97 82.91,16.97 84.02,15.85 88.7,15.85 89.61,16.76 89.61,26.92 88.8,27.74 86.46,27.74 85.85,28.35 RST.1 85.75,28.45 81.89,28.45 RST.5 81.79,28.45 80.77,29.46 72.03,29.46 71.83,29.26 71.83,29.06 68.48,25.7 v56.9,25.7
  Bottom 0.203: v41.15,23.16 41.15,23.98 44.04,26.87 | 44.04,26.87 45.11,27.94 46.33,27.94 ISP.4 | v56.9,25.7 54.25,25.7 53.34,24.79 46.13,24.79 44.09,26.82 44.04,26.87
ROW1  (via drill 0.3)
  Top 0.203: v50.49,4.47 49.89,4.47 49.17,5.18 45.41,5.18 44.6,5.99 44.4,5.99 IC1.51
  Bottom 0.203: v50.49,4.47 50.7,4.47 51.41,3.76 60.55,3.76 62.38,1.93 ROWS.1
SCLK
  Top 0.203: IC1.11 46.02,21.54 48.97,24.49 48.97,27.94 ISP.3
USB_D+  (via drill 0.3)
  Top 0.203: v48.97,16.76 48.97,17.58 49.28,17.88 49.28,18.09 IC1.5 | v71.93,18.59 71.93,19.91 R4.2
  Bottom 0.203: v48.97,16.76 51.41,16.76 53.54,14.63 64.52,14.63 67.87,17.98 71.32,17.98 v71.93,18.59
USB_D-  (via drill 0.3)
  Top 0.203: v51.31,19 49.99,17.68 IC1.4 | v71.02,18.59 72.14,17.48 73.76,17.48 R3.2
  Bottom 0.203: v51.31,19 55.47,19 55.88,18.59 v71.02,18.59
VCC  (via drill 0.41)  (1 unrouted)
  Top 0.457: LED.4 88.19,9.45 88.19,13.41 87.68,13.92 R7.2 87.58,14.12 85.24,14.12 R5.2 85.04,14.12 80.97,14.12 R6.1 80.77,14.02 73.05,14.02 70.31,11.28 +5V.1 70.1,11.18 70,11.28 65.73,11.28 C5.+ | v77.22,19 77.22,25.3 USB.1 | 41.91,22.81 41.96,22.86 41.96,28.25 C4.2 | 41.91,22.81 40.64,21.54 38.81,21.54 38.41,21.95 IC1.21 | 44.2,20.52 42.06,22.66 41.91,22.81 | 44.2,20.52 45.41,19.3 47.14,19.3 47.65,19.81 IC1.8 47.85,19.91 48.26,20.32 51.1,20.32 52.12,19.3 52.12,18.69 50.6,17.17 IC1.3 50.39,16.97 49.89,16.46 49.89,14.22 49.89,14.02 | v43.89,20.22 44.09,20.42 44.2,20.52 | R9.2 1.83,19.61 1.83,18.69 4.47,16.05 C16.2 4.57,15.85 4.57,12.39 C15.2 4.47,12.19 4.47,10.46 3.35,9.35 3.35,3.35 5.38,1.32 22.25,1.32 24.59,3.66 24.59,7.11 R8.2 24.69,7.32 24.69,10.87 25.4,11.58 R1.1 25.6,11.58 27.94,11.58 R2.1 28.14,11.48 v29.97,11.48 | 43.79,8.53 43.79,7.72 44.81,6.71 IC1.52 | 43.79,8.53 49.28,14.02 49.89,14.02 | 49.89,14.02 50.8,14.02 51.51,13.31 IC1.64 51.71,13.31 56.29,17.88 56.29,19 56.9,19.61 64.82,19.61 SER.TIP | v41.55,9.75 42.47,9.75 43.59,8.64 43.79,8.53
  Bottom 0.457: v77.22,19 77.22,18.19 70.21,11.18 +5V.1 | v43.89,20.22 43.89,18.9 C7.2 43.99,18.69 47.04,15.65 47.04,14.63 C6.2 47.24,14.43 50.29,11.38 65.63,11.38 C5.+ | v41.55,9.75 40.23,9.75 C8.2 40.03,9.96 38.51,11.48 v29.97,11.48

### Text on the board
tNames: CA1 | 1 | INT4 | SCL | SDA | HWB | COLUMS | 9 | LEDs | 1 | 1 | COLUMS | ROWS | COLUMS | CB1 | A | 17
bNames: CA1 | 1 | LEFT | COLUMS | 9 | 1 | 1 | COLUMS | ROWS | COLUMS | CB1 | A | 17